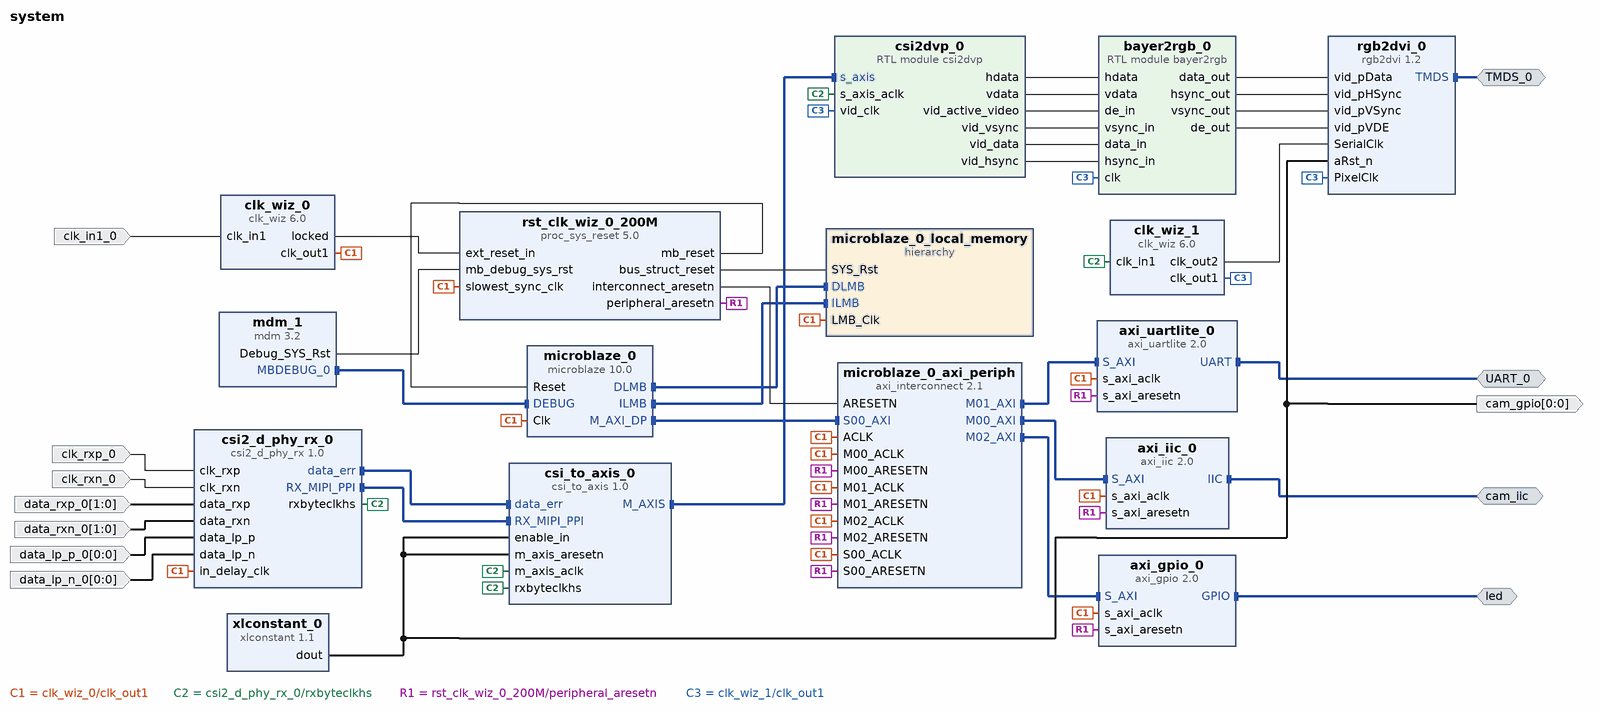
[diagram p0: block diagram of the top level]
# Vivado block design system, xc7s15ftgb196-1, Vivado 2018.2
create_bd_design system

create_bd_intf_port -mode Master -vlnv xilinx.com:interface:iic_rtl:1.0 cam_iic
create_bd_intf_port -mode Master -vlnv xilinx.com:interface:uart_rtl:1.0 UART_0
create_bd_intf_port -mode Master -vlnv xilinx.com:interface:gpio_rtl:1.0 led
create_bd_intf_port -mode Master -vlnv digilentinc.com:interface:tmds_rtl:1.0 TMDS_0
create_bd_port -dir I -type clk clk_in1_0
create_bd_port -dir I clk_rxp_0
create_bd_port -dir I clk_rxn_0
create_bd_port -dir I -from 1 -to 0 data_rxp_0
create_bd_port -dir I -from 1 -to 0 data_rxn_0
create_bd_port -dir I -from 0 -to 0 data_lp_p_0
create_bd_port -dir I -from 0 -to 0 data_lp_n_0
create_bd_port -dir O -from 0 -to 0 cam_gpio

create_bd_cell -type ip -vlnv xilinx.com:ip:clk_wiz:6.0 clk_wiz_0
set_property -dict [list \
  CONFIG.CLKOUT1_REQUESTED_OUT_FREQ 200.000 \
  CONFIG.USE_LOCKED true \
  CONFIG.USE_RESET false \
  CONFIG.MMCM_DIVCLK_DIVIDE 1 \
  CONFIG.MMCM_CLKOUT0_DIVIDE_F 5.000 \
  CONFIG.CLKOUT1_JITTER 114.829 \
] [get_bd_cells clk_wiz_0]
create_bd_cell -type ip -vlnv xilinx.com:ip:xlconstant:1.1 xlconstant_0
create_bd_cell -type ip -vlnv trenz.biz:user:csi2_d_phy_rx:1.0 csi2_d_phy_rx_0
set_property -dict {CONFIG.C_ADD_IDELAYCTRL true CONFIG.C_CALIB_WAIT 8191 CONFIG.C_RATE_LIMIT 50} [get_bd_cells csi2_d_phy_rx_0]
create_bd_cell -type ip -vlnv trenz.biz:user:csi_to_axis:1.0 csi_to_axis_0
set_property -dict {CONFIG.C_TIMEOUT 255} [get_bd_cells csi_to_axis_0]
create_bd_cell -type ip -vlnv xilinx.com:ip:microblaze:10.0 microblaze_0
set_property -dict {CONFIG.C_D_AXI 1 CONFIG.C_D_LMB 1 CONFIG.C_I_LMB 1 CONFIG.C_DEBUG_ENABLED 1} [get_bd_cells microblaze_0]
create_bd_cell -type hier microblaze_0_local_memory
create_bd_cell -type ip -vlnv xilinx.com:ip:mdm:3.2 mdm_1
create_bd_cell -type ip -vlnv xilinx.com:ip:proc_sys_reset:5.0 rst_clk_wiz_0_200M
create_bd_cell -type ip -vlnv xilinx.com:ip:axi_iic:2.0 axi_iic_0
create_bd_cell -type ip -vlnv xilinx.com:ip:axi_interconnect:2.1 microblaze_0_axi_periph
set_property -dict {CONFIG.NUM_MI 3} [get_bd_cells microblaze_0_axi_periph]
create_bd_cell -type ip -vlnv xilinx.com:ip:clk_wiz:6.0 clk_wiz_1
set_property -dict [list \
  CONFIG.CLKOUT2_USED true \
  CONFIG.NUM_OUT_CLKS 2 \
  CONFIG.CLKOUT2_REQUESTED_OUT_FREQ 500.000 \
  CONFIG.USE_LOCKED false \
  CONFIG.USE_RESET false \
  CONFIG.MMCM_DIVCLK_DIVIDE 1 \
  CONFIG.MMCM_CLKOUT1_DIVIDE 2 \
  CONFIG.CLKOUT2_JITTER 97.082 \
  CONFIG.CLKOUT2_PHASE_ERROR 98.575 \
] [get_bd_cells clk_wiz_1]
create_bd_cell -type ip -vlnv xilinx.com:ip:axi_uartlite:2.0 axi_uartlite_0
set_property -dict {CONFIG.C_BAUDRATE 115200} [get_bd_cells axi_uartlite_0]
create_bd_cell -type ip -vlnv xilinx.com:ip:axi_gpio:2.0 axi_gpio_0
set_property -dict {CONFIG.C_GPIO_WIDTH 2 CONFIG.C_ALL_OUTPUTS 1} [get_bd_cells axi_gpio_0]
create_bd_cell -type module -reference bayer2rgb bayer2rgb_0
create_bd_cell -type module -reference csi2dvp csi2dvp_0
create_bd_cell -type ip -vlnv digilentinc.com:ip:rgb2dvi:1.2 rgb2dvi_0
set_property -dict {CONFIG.kRstActiveHigh false CONFIG.kGenerateSerialClk false} [get_bd_cells rgb2dvi_0]

# ---- hierarchy /microblaze_0_local_memory ----
current_bd_instance /microblaze_0_local_memory
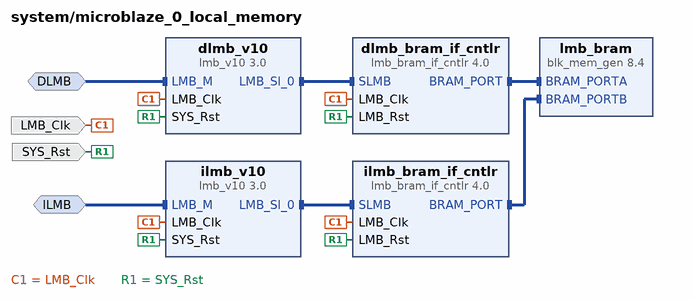
[diagram p1: block diagram inside /microblaze_0_local_memory]
create_bd_intf_pin -mode MirroredMaster -vlnv xilinx.com:interface:lmb_rtl:1.0 DLMB
create_bd_intf_pin -mode MirroredMaster -vlnv xilinx.com:interface:lmb_rtl:1.0 ILMB
create_bd_pin -dir I -type clk LMB_Clk
create_bd_pin -dir I -type rst SYS_Rst

create_bd_cell -type ip -vlnv xilinx.com:ip:lmb_v10:3.0 dlmb_v10
create_bd_cell -type ip -vlnv xilinx.com:ip:lmb_v10:3.0 ilmb_v10
create_bd_cell -type ip -vlnv xilinx.com:ip:lmb_bram_if_cntlr:4.0 dlmb_bram_if_cntlr
set_property -dict {CONFIG.C_ECC 0} [get_bd_cells dlmb_bram_if_cntlr]
create_bd_cell -type ip -vlnv xilinx.com:ip:lmb_bram_if_cntlr:4.0 ilmb_bram_if_cntlr
set_property -dict {CONFIG.C_ECC 0} [get_bd_cells ilmb_bram_if_cntlr]
create_bd_cell -type ip -vlnv xilinx.com:ip:blk_mem_gen:8.4 lmb_bram
set_property -dict {CONFIG.Memory_Type True_Dual_Port_RAM CONFIG.use_bram_block BRAM_Controller} [get_bd_cells lmb_bram]

# ---- connections ----

current_bd_instance /microblaze_0_local_memory
connect_bd_intf_net -intf_net microblaze_0_dlmb_bus [get_bd_intf_pins dlmb_v10/LMB_Sl_0] [get_bd_intf_pins dlmb_bram_if_cntlr/SLMB]
connect_bd_intf_net -intf_net microblaze_0_ilmb_bus [get_bd_intf_pins ilmb_v10/LMB_Sl_0] [get_bd_intf_pins ilmb_bram_if_cntlr/SLMB]
connect_bd_intf_net -intf_net microblaze_0_dlmb_cntlr [get_bd_intf_pins dlmb_bram_if_cntlr/BRAM_PORT] [get_bd_intf_pins lmb_bram/BRAM_PORTA]
connect_bd_intf_net -intf_net microblaze_0_ilmb_cntlr [get_bd_intf_pins ilmb_bram_if_cntlr/BRAM_PORT] [get_bd_intf_pins lmb_bram/BRAM_PORTB]
connect_bd_intf_net -intf_net microblaze_0_dlmb [get_bd_intf_pins DLMB] [get_bd_intf_pins dlmb_v10/LMB_M]
connect_bd_intf_net -intf_net microblaze_0_ilmb [get_bd_intf_pins ILMB] [get_bd_intf_pins ilmb_v10/LMB_M]
connect_bd_net -net microblaze_0_Clk [get_bd_pins LMB_Clk] \
  [get_bd_pins dlmb_v10/LMB_Clk] [get_bd_pins dlmb_bram_if_cntlr/LMB_Clk] [get_bd_pins ilmb_v10/LMB_Clk] \
  [get_bd_pins ilmb_bram_if_cntlr/LMB_Clk]
connect_bd_net [get_bd_pins SYS_Rst] \
  [get_bd_pins dlmb_v10/SYS_Rst] [get_bd_pins dlmb_bram_if_cntlr/LMB_Rst] [get_bd_pins ilmb_v10/SYS_Rst] \
  [get_bd_pins ilmb_bram_if_cntlr/LMB_Rst]

current_bd_instance /
connect_bd_intf_net [get_bd_intf_pins csi2_d_phy_rx_0/data_err] [get_bd_intf_pins csi_to_axis_0/data_err]
connect_bd_intf_net [get_bd_intf_pins csi2_d_phy_rx_0/RX_MIPI_PPI] [get_bd_intf_pins csi_to_axis_0/RX_MIPI_PPI]
connect_bd_intf_net [get_bd_intf_pins microblaze_0/DLMB] [get_bd_intf_pins microblaze_0_local_memory/DLMB]
connect_bd_intf_net [get_bd_intf_pins microblaze_0/ILMB] [get_bd_intf_pins microblaze_0_local_memory/ILMB]
connect_bd_intf_net [get_bd_intf_pins mdm_1/MBDEBUG_0] [get_bd_intf_pins microblaze_0/DEBUG]
connect_bd_intf_net [get_bd_intf_pins microblaze_0/M_AXI_DP] [get_bd_intf_pins microblaze_0_axi_periph/S00_AXI]
connect_bd_intf_net [get_bd_intf_pins microblaze_0_axi_periph/M00_AXI] [get_bd_intf_pins axi_iic_0/S_AXI]
connect_bd_intf_net [get_bd_intf_pins csi_to_axis_0/M_AXIS] [get_bd_intf_pins csi2dvp_0/s_axis]
connect_bd_intf_net [get_bd_intf_pins microblaze_0_axi_periph/M01_AXI] [get_bd_intf_pins axi_uartlite_0/S_AXI]
connect_bd_intf_net [get_bd_intf_pins microblaze_0_axi_periph/M02_AXI] [get_bd_intf_pins axi_gpio_0/S_AXI]
connect_bd_intf_net [get_bd_intf_ports cam_iic] [get_bd_intf_pins axi_iic_0/IIC]
connect_bd_intf_net [get_bd_intf_ports UART_0] [get_bd_intf_pins axi_uartlite_0/UART]
connect_bd_intf_net [get_bd_intf_ports led] [get_bd_intf_pins axi_gpio_0/GPIO]
connect_bd_intf_net [get_bd_intf_ports TMDS_0] [get_bd_intf_pins rgb2dvi_0/TMDS]
connect_bd_net -net clk_in1_0_1 [get_bd_ports clk_in1_0] [get_bd_pins clk_wiz_0/clk_in1]
connect_bd_net -net microblaze_0_Clk [get_bd_pins clk_wiz_0/clk_out1] \
  [get_bd_pins csi2_d_phy_rx_0/in_delay_clk] [get_bd_pins microblaze_0/Clk] [get_bd_pins rst_clk_wiz_0_200M/slowest_sync_clk] \
  [get_bd_pins axi_iic_0/s_axi_aclk] [get_bd_pins axi_uartlite_0/s_axi_aclk] [get_bd_pins axi_gpio_0/s_axi_aclk] \
  [get_bd_pins microblaze_0_local_memory/LMB_Clk] [get_bd_pins microblaze_0_axi_periph/S00_ACLK] \
  [get_bd_pins microblaze_0_axi_periph/M00_ACLK] [get_bd_pins microblaze_0_axi_periph/ACLK] \
  [get_bd_pins microblaze_0_axi_periph/M01_ACLK] [get_bd_pins microblaze_0_axi_periph/M02_ACLK]
connect_bd_net -net clk_rxp_0_1 [get_bd_ports clk_rxp_0] [get_bd_pins csi2_d_phy_rx_0/clk_rxp]
connect_bd_net -net clk_rxn_0_1 [get_bd_ports clk_rxn_0] [get_bd_pins csi2_d_phy_rx_0/clk_rxn]
connect_bd_net -net data_rxp_0_1 [get_bd_ports data_rxp_0] [get_bd_pins csi2_d_phy_rx_0/data_rxp]
connect_bd_net -net data_rxn_0_1 [get_bd_ports data_rxn_0] [get_bd_pins csi2_d_phy_rx_0/data_rxn]
connect_bd_net -net data_lp_p_0_1 [get_bd_ports data_lp_p_0] [get_bd_pins csi2_d_phy_rx_0/data_lp_p]
connect_bd_net -net data_lp_n_0_1 [get_bd_ports data_lp_n_0] [get_bd_pins csi2_d_phy_rx_0/data_lp_n]
connect_bd_net [get_bd_pins csi2_d_phy_rx_0/rxbyteclkhs] \
  [get_bd_pins csi_to_axis_0/rxbyteclkhs] [get_bd_pins csi_to_axis_0/m_axis_aclk] [get_bd_pins clk_wiz_1/clk_in1] \
  [get_bd_pins csi2dvp_0/s_axis_aclk]
connect_bd_net [get_bd_pins xlconstant_0/dout] \
  [get_bd_ports cam_gpio] [get_bd_pins csi_to_axis_0/m_axis_aresetn] [get_bd_pins csi_to_axis_0/enable_in] \
  [get_bd_pins rgb2dvi_0/aRst_n]
connect_bd_net [get_bd_pins rst_clk_wiz_0_200M/mb_reset] [get_bd_pins microblaze_0/Reset]
connect_bd_net [get_bd_pins rst_clk_wiz_0_200M/bus_struct_reset] [get_bd_pins microblaze_0_local_memory/SYS_Rst]
connect_bd_net [get_bd_pins mdm_1/Debug_SYS_Rst] [get_bd_pins rst_clk_wiz_0_200M/mb_debug_sys_rst]
connect_bd_net [get_bd_pins clk_wiz_0/locked] [get_bd_pins rst_clk_wiz_0_200M/ext_reset_in]
connect_bd_net [get_bd_pins rst_clk_wiz_0_200M/peripheral_aresetn] \
  [get_bd_pins axi_iic_0/s_axi_aresetn] [get_bd_pins axi_uartlite_0/s_axi_aresetn] [get_bd_pins axi_gpio_0/s_axi_aresetn] \
  [get_bd_pins microblaze_0_axi_periph/S00_ARESETN] [get_bd_pins microblaze_0_axi_periph/M00_ARESETN] \
  [get_bd_pins microblaze_0_axi_periph/M01_ARESETN] [get_bd_pins microblaze_0_axi_periph/M02_ARESETN]
connect_bd_net [get_bd_pins rst_clk_wiz_0_200M/interconnect_aresetn] [get_bd_pins microblaze_0_axi_periph/ARESETN]
connect_bd_net [get_bd_pins clk_wiz_1/clk_out1] [get_bd_pins bayer2rgb_0/clk] [get_bd_pins csi2dvp_0/vid_clk] [get_bd_pins rgb2dvi_0/PixelClk]
connect_bd_net [get_bd_pins csi2dvp_0/hdata] [get_bd_pins bayer2rgb_0/hdata]
connect_bd_net [get_bd_pins csi2dvp_0/vdata] [get_bd_pins bayer2rgb_0/vdata]
connect_bd_net [get_bd_pins csi2dvp_0/vid_active_video] [get_bd_pins bayer2rgb_0/de_in]
connect_bd_net [get_bd_pins csi2dvp_0/vid_vsync] [get_bd_pins bayer2rgb_0/vsync_in]
connect_bd_net [get_bd_pins csi2dvp_0/vid_data] [get_bd_pins bayer2rgb_0/data_in]
connect_bd_net [get_bd_pins csi2dvp_0/vid_hsync] [get_bd_pins bayer2rgb_0/hsync_in]
connect_bd_net [get_bd_pins bayer2rgb_0/data_out] [get_bd_pins rgb2dvi_0/vid_pData]
connect_bd_net [get_bd_pins bayer2rgb_0/hsync_out] [get_bd_pins rgb2dvi_0/vid_pHSync]
connect_bd_net [get_bd_pins bayer2rgb_0/vsync_out] [get_bd_pins rgb2dvi_0/vid_pVSync]
connect_bd_net [get_bd_pins bayer2rgb_0/de_out] [get_bd_pins rgb2dvi_0/vid_pVDE]
connect_bd_net [get_bd_pins clk_wiz_1/clk_out2] [get_bd_pins rgb2dvi_0/SerialClk]

# ---- address map ----
assign_bd_address -offset 0x00000000 -range 8K -target_address_space [get_bd_addr_spaces microblaze_0/Data] [get_bd_addr_segs microblaze_0_local_memory/dlmb_bram_if_cntlr/SLMB/Mem]
assign_bd_address -offset 0x40000000 -range 64K -target_address_space [get_bd_addr_spaces microblaze_0/Data] [get_bd_addr_segs axi_gpio_0/S_AXI/Reg]
assign_bd_address -offset 0x40600000 -range 64K -target_address_space [get_bd_addr_spaces microblaze_0/Data] [get_bd_addr_segs axi_uartlite_0/S_AXI/Reg]
assign_bd_address -offset 0x40800000 -range 64K -target_address_space [get_bd_addr_spaces microblaze_0/Data] [get_bd_addr_segs axi_iic_0/S_AXI/Reg]
assign_bd_address -offset 0x00000000 -range 8K -target_address_space [get_bd_addr_spaces microblaze_0/Instruction] [get_bd_addr_segs microblaze_0_local_memory/ilmb_bram_if_cntlr/SLMB/Mem]

validate_bd_design
save_bd_design
